# EAGLE design l293DC (EAGLE 6.2)
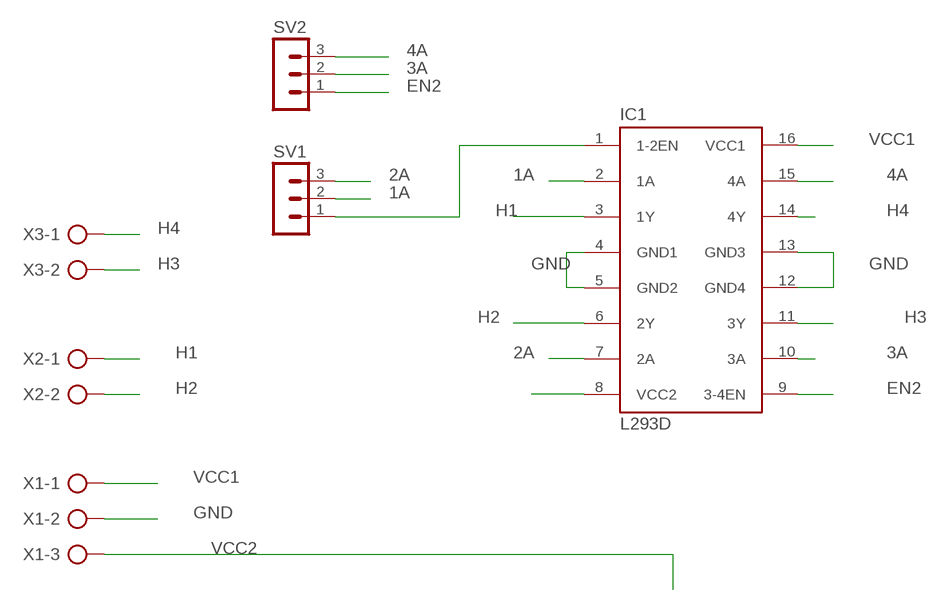
[diagram p0: schematic, sheet 1]

## Parts
IC1  L293D  [DIL16]
SV1  MA03-1  [MA03-1]
SV2  MA03-1  [MA03-1]
X1  AK500/3  [AK500/3]
X2  AK500/2  [AK500/2]
X3  AK500/2  [AK500/2]

## Nets
1A: IC1.2(1A) SV1.2
2A: IC1.7(2A) SV1.3
3A: IC1.10(3A) SV2.2
4A: IC1.15(4A) SV2.3
EN2: IC1.9(3-4EN) SV2.1
GND: IC1.4(GND1) IC1.5(GND2) IC1.12(GND4) IC1.13(GND3) X1.2
H1: IC1.3(1Y) X2.1
H2: IC1.6(2Y) X2.2
H3: IC1.11(3Y) X3.2
H4: IC1.14(4Y) X3.1
N$1: IC1.1(1-2EN) SV1.1
VCC1: IC1.16(VCC1) X1.1
VCC2: IC1.8(VCC2) X1.3

## Library data of the parts
IC1 = st-microelectronics:L293D: PUSH-PULL 4 CHANNEL DRIVER; MPN: L293D; OC_FARNELL: 9589619; OC_NEWARK: 56P8249
SV1 SV2 = con-lstb:MA03-1: PIN HEADER; OC_FARNELL: unknown; OC_NEWARK: unknown
X1 = con-ptr500:AK500/3: CONNECTOR; OC_FARNELL: unknown; OC_NEWARK: unknown
X2 X3 = con-ptr500:AK500/2: CONNECTOR; OC_FARNELL: unknown; OC_NEWARK: unknown

## Board
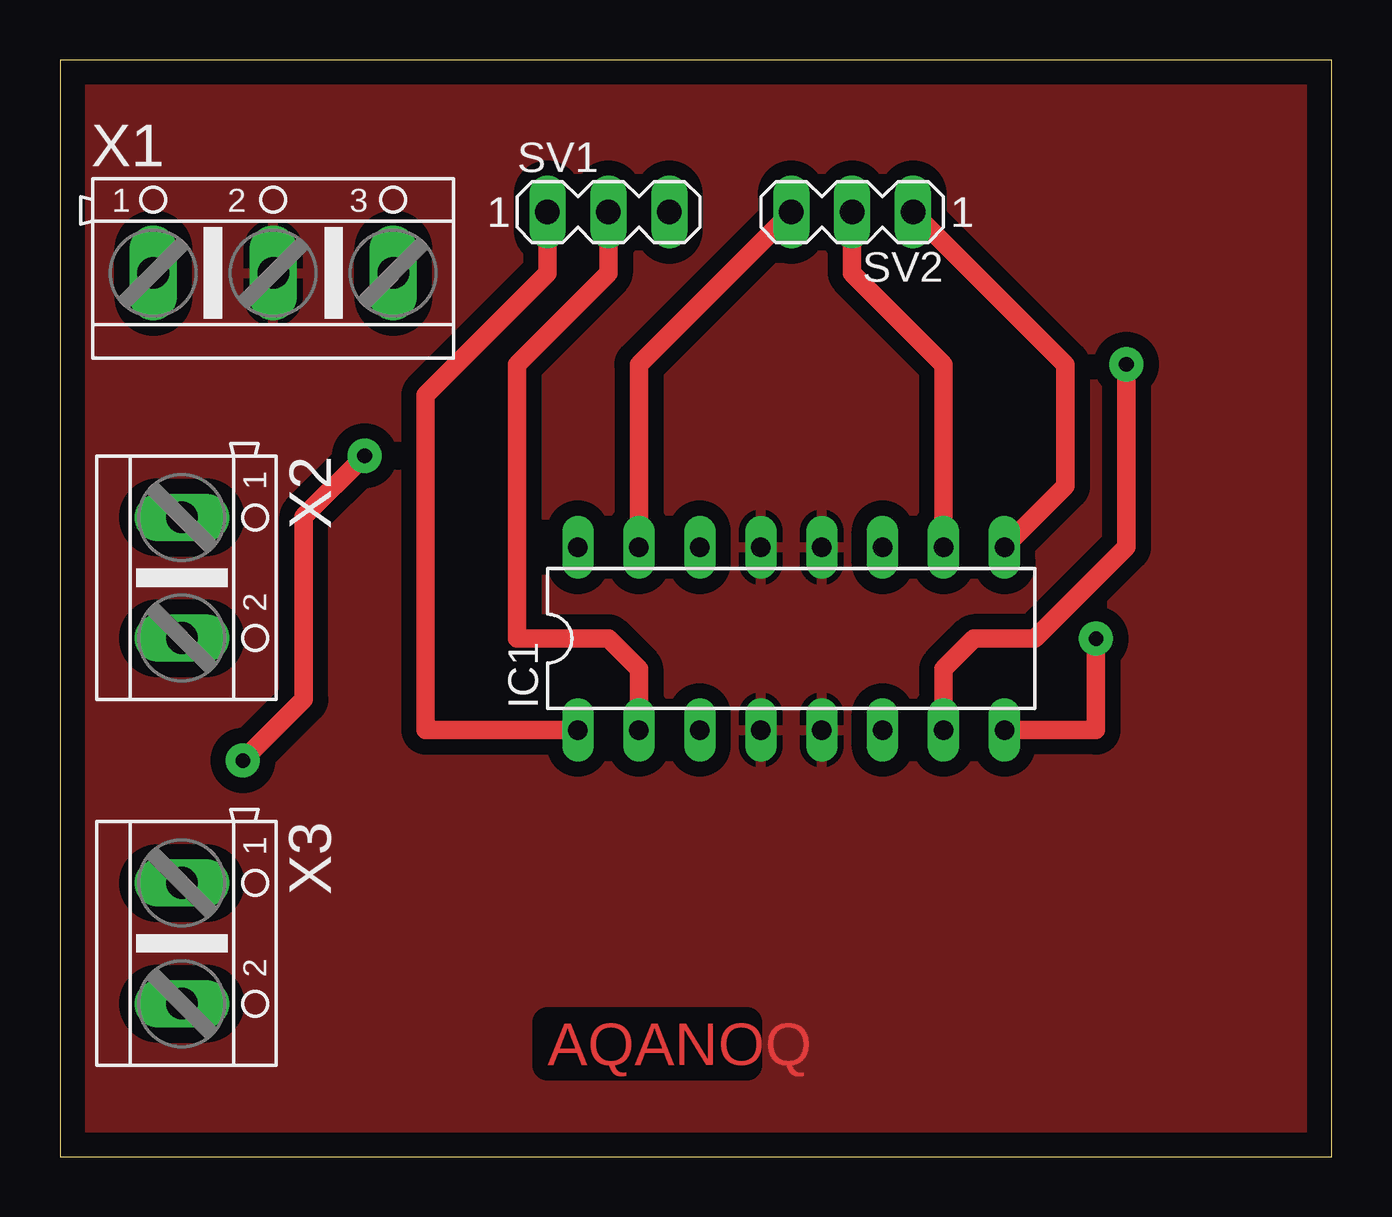
[diagram p1: board, top side]
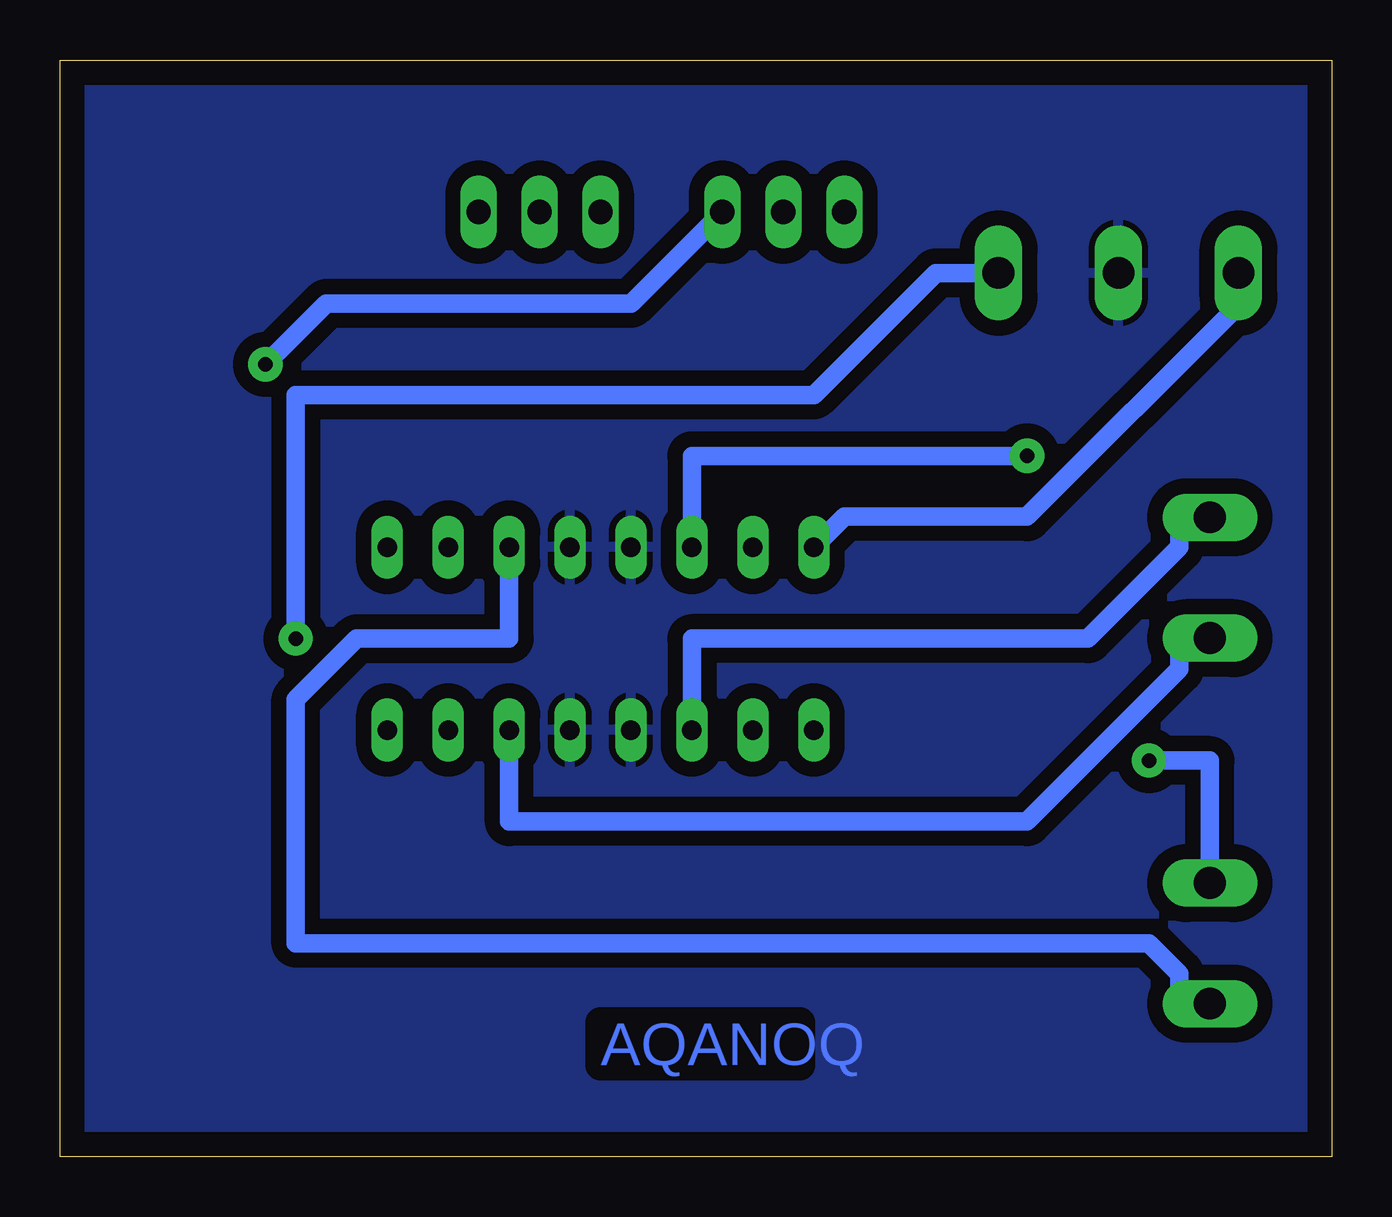
[diagram p2: board, bottom side, seen from below]

Size 53.01 x 45.71 mm. Coordinates in mm from the lower left corner, seen from the top.
Outline: 0,0 53.01,0 53.01,45.71 0,45.71 0,0
Copper layers (1*16): Top 0.035mm / dielectric 1.5mm / Bottom 0.035mm
Design rules: minimum track width 30mil, minimum drill 24mil, track to track 25mil, track to pad 25mil, pad to pad 25mil, via to via 25mil, smd to smd 8mil, copper to edge 40mil, drill to drill 8mil, minimum pad ring 10mil, minimum via ring 8mil, stop-mask expansion 4mil, vias tented up to drill 0mil, thermal gap 10mil

### Footprints (pad centres in the part's own frame; a part is rotated, then mirrored left to right if it is on the bottom)
DIL16 = drill 0.813 long: 1 -8.89,-3.81; 2 -6.35,-3.81; 3 -3.81,-3.81; 4 -1.27,-3.81; 5 1.27,-3.81; 6 3.81,-3.81; 7 6.35,-3.81; 8 8.89,-3.81; 9 8.89,3.81; 10 6.35,3.81; 11 3.81,3.81; 12 1.27,3.81; 13 -1.27,3.81; 14 -3.81,3.81; 15 -6.35,3.81; 16 -8.89,3.81
MA03-1 = drill 1.016 long: 1 -2.54,0; 2 0,0; 3 2.54,0
AK500/3 = drill 1.321 long: 1 -5.004,0; 2 0,0; 3 5.004,0
AK500/2 = drill 1.321 long: 1 -2.515,0; 2 2.515,0

### Placement (x,y rotation side)
IC1  30.48,21.59 0 top
SV1  22.86,39.37 0 top
SV2  33.02,39.37 180 top
X1  8.89,36.83 0 top
X2  5.08,24.13 270 top
X3  5.08,8.89 270 top

### Tracks (layer width: path | path; a pad name or v marks a point on that pad's centre or on a via)
1A
  Top 0.762: IC1.2 24.13,20.32 22.86,21.59 19.05,21.59 19.05,33.02 22.86,36.83 SV1.2
2A  (via drill 0.61 pad 1.42)
  Top 0.762: IC1.7 36.83,20.32 38.1,21.59 40.64,21.59 44.45,25.4 v44.45,33.02
  Bottom 0.762: v44.45,33.02 41.91,35.56 29.21,35.56 SV1.3
3A
  Top 0.762: IC1.10 36.83,33.02 33.02,36.83 SV2.2
4A
  Top 0.762: IC1.15 24.13,33.02 SV2.3
EN2
  Top 0.762: IC1.9 41.91,27.94 41.91,33.02 SV2.1
GND
  pour Bottom: 0,45.72 53.34,45.72 53.34,0 0,0
  pour Top: 0,45.72 53.34,45.72 53.34,0 0,0
H1
  Bottom 0.762: IC1.3 26.67,21.59 10.16,21.59 6.35,25.4 6.35,26.67 5.08,26.67 X2.1
H2
  Bottom 0.762: IC1.6 34.29,13.97 12.7,13.97 6.35,20.32 6.35,21.59 5.08,21.59 X2.2
H3
  Bottom 0.762: IC1.11 34.29,21.59 40.64,21.59 43.18,19.05 43.18,8.89 7.62,8.89 6.35,7.62 6.35,6.35 5.08,6.35 X3.2
H4  (via drill 0.6 pad 1.42, 0.61 pad 1.42)
  Top 0.762: v12.7,29.21 10.16,26.67 10.16,19.05 v7.62,16.51
  Bottom 0.762: IC1.14 26.67,29.21 v12.7,29.21 | X3.1 5.08,16.51 v7.62,16.51
N$1
  Top 0.762: IC1.1 15.24,17.78 15.24,31.75 20.32,36.83 SV1.1
N$3
  pour Bottom: 0,45.72 2.54,45.72
VCC1
  Bottom 0.762: IC1.16 20.32,26.67 12.7,26.67 3.81,35.56 3.81,36.83 X1.1
VCC2  (via drill 0.61 pad 1.42)
  Top 0.762: IC1.8 43.18,17.78 v43.18,21.59
  Bottom 0.762: v43.18,21.59 43.18,31.75 21.59,31.75 16.51,36.83 X1.3

### Text on the board
Top: AQANOQ
Bottom: AQANOQ